# Altium project PCB_test.PrjPcb
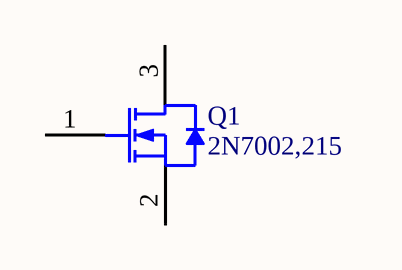
[diagram p0: Sheet1.SchDoc]
1 sheet, 1 parts. Net scope: global (net labels, ports and power ports of the same name join across sheets).
Board file: PCB2.PcbDoc

## Sheet Sheet1.SchDoc
size A4; SheetNumber: 1; SheetTotal: 1

### Parts
Q1  2N7002,215  [NXP-SOT23-3_V]

### Nets

Not connected (* = marked no-connect by the designer): Q1 1(G) 2(S) 3(D)

### Library data of the parts
Q1 = CMP-013-00011-4: N-channel Trench MOSFET, 60 V, 300 mA, -65 to 150 degC, 3-Pin SOT-23 (TO-236AB), RoHS, Tape and Reel; Manufacturer: NXP Semiconductors; Elements: 1; Power: 830mW; Max Dual Supply Voltage: 60V; Rds On Max: 5Ohm; Package Version: Feb-16; Nominal Vgs: 2V; Input Capacitance: 50pF; RoHS Compliant: True; Datasheet URL: http://www.nxp.com/documents/data_sheet/2N7002.pdf; Packaging: TapeandReel; Case/Package: TO-236-3; Package Reference: SOT23-3; Max Operating Temperature: 150°C; Pins: 8; Mounting Technology: SM; Package Quantity: 1; Datasheet Version: Rev. 7, 09/2011; Nominal Dual Supply Voltage: 60V; Min Operating Temperature: -65°C; Package Description: 3-Pin Small Outline Transistor, Body 1.3 x 2.9 mm, Pitch 0.95 mm; Vds Max: 60V